# Altium schematic sheet EnvMonitor.SchDoc
size A4
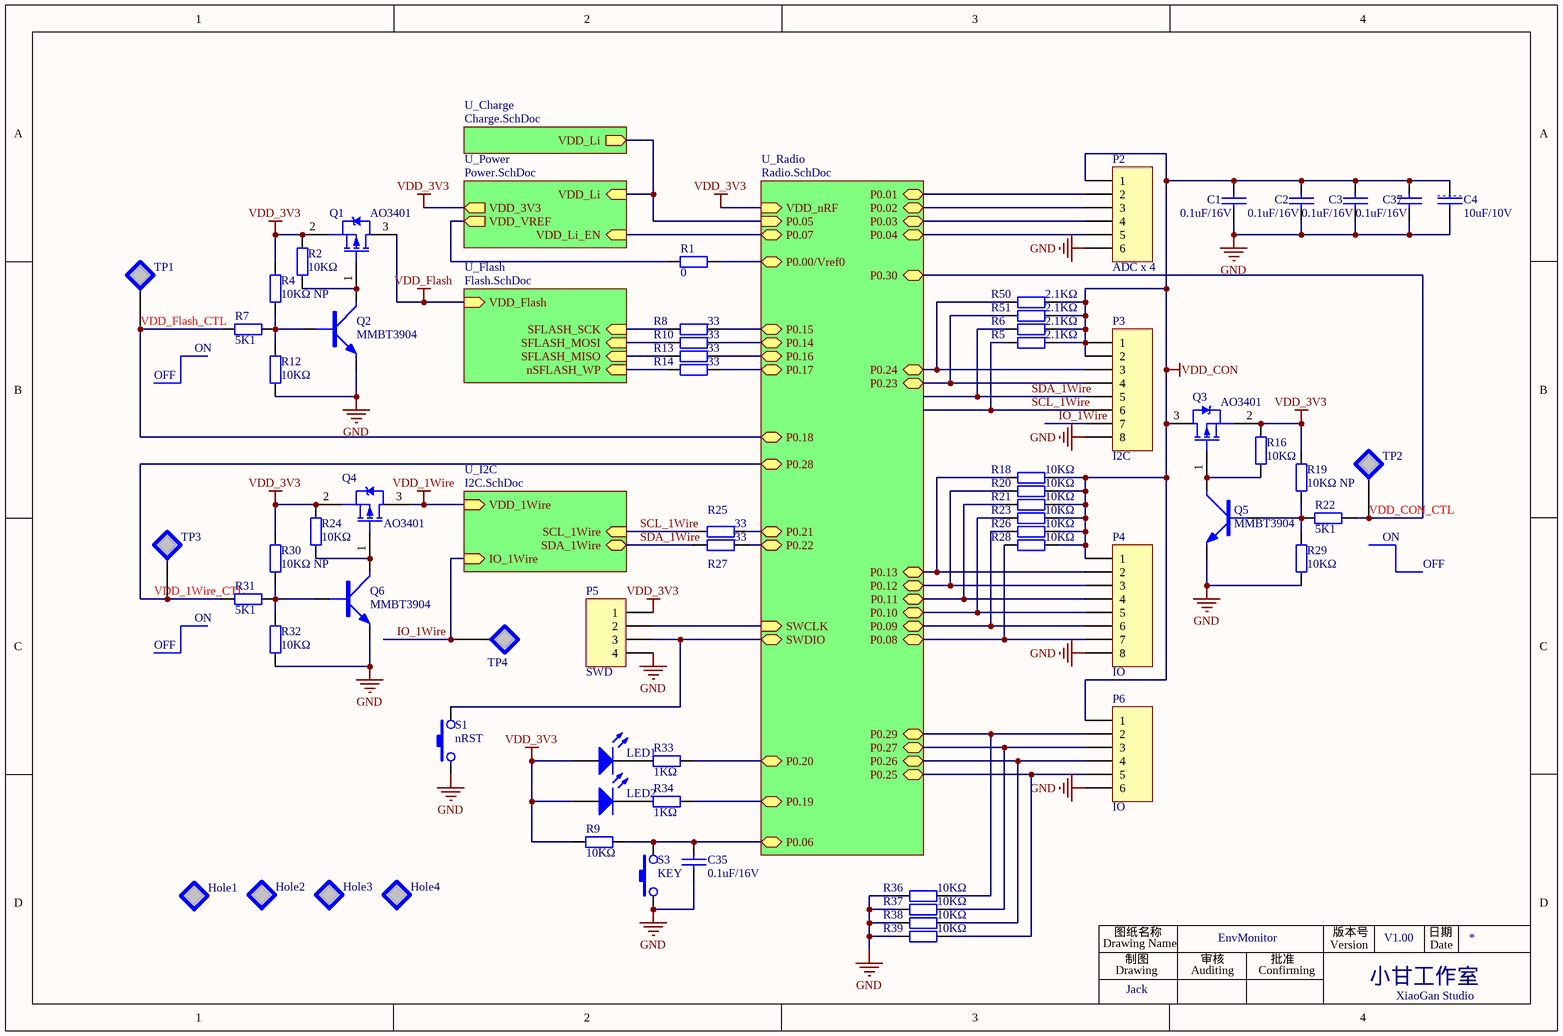
[diagram p0: EnvMonitor.SchDoc]

## Parts
C1  0.1uF/16V  [0603R]
C2  0.1uF/16V  [0603R]
C3  0.1uF/16V  [0603R]
C4  10uF/10V  [0805R]
C35  0.1uF/16V  [0603R]
C37  0.1uF/16V  [0603R]
Hole1  (no value)  [HOLE-3.2]  (no BOM)
Hole2  (no value)  [HOLE-3.2]  (no BOM)
Hole3  (no value)  [HOLE-3.2]  (no BOM)
Hole4  (no value)  [HOLE-3.2]  (no BOM)
LED1  LED_0603  [LED-0603]  (value not drawn)
LED2  LED_0603  [LED-0603]  (value not drawn)
P2  ADC x 4  [CON6-2.0]
P3  I2C  [CON8-2.0]
P4  IO  [CON8-2.0]
P5  SWD  [CON4-2.0]
P6  IO  [CON6-2.0]
Q1  AO3401  [SOT-23]
Q2  MMBT3904  [SOT-23]
Q3  AO3401  [SOT-23]
Q4  AO3401  [SOT-23]
Q5  MMBT3904  [SOT-23]
Q6  MMBT3904  [SOT-23]
R1  0  [0603R]
R2  10KΩ  [0603R]
R4  10KΩ NP  [0603R]
R5  2.1KΩ  [0603R]
R6  2.1KΩ  [0603R]
R7  5K1  [0603R]
R8  33  [0603R]
R9  10KΩ  [0603R]
R10  33  [0603R]
R12  10KΩ  [0603R]
R13  33  [0603R]
R14  33  [0603R]
R16  10KΩ  [0603R]
R18  10KΩ  [0603R]
R19  10KΩ NP  [0603R]
R20  10KΩ  [0603R]
R21  10KΩ  [0603R]
R22  5K1  [0603R]
R23  10KΩ  [0603R]
R24  10KΩ  [0603R]
R25  33  [0603R]
R26  10KΩ  [0603R]
R27  33  [0603R]
R28  10KΩ  [0603R]
R29  10KΩ  [0603R]
R30  10KΩ NP  [0603R]
R31  5K1  [0603R]
R32  10KΩ  [0603R]
R33  1KΩ  [0603R]
R34  1KΩ  [0603R]
R36  10KΩ  [0603R]
R37  10KΩ  [0603R]
R38  10KΩ  [0603R]
R39  10KΩ  [0603R]
R50  2.1KΩ  [0603R]
R51  2.1KΩ  [0603R]
S1  nRST  [KEY-6S]
S3  KEY  [KEY-6S]
TP1  (no value)  [MARKER-C]  (no BOM)
TP2  (no value)  [MARKER-C]  (no BOM)
TP3  (no value)  [MARKER-C]  (no BOM)
TP4  (no value)  [MARKER-C]  (no BOM)

## Sub-sheets
U_Charge = Charge.SchDoc: VDD_Li (out)
U_Flash = Flash.SchDoc: SFLASH_SCK (in), SFLASH_MOSI (in), SFLASH_MISO (in), nSFLASH_WP (in), VDD_Flash (in)
U_I2C = I2C.SchDoc: VDD_1Wire (in), IO_1Wire (in), SDA_1Wire (bidir), SCL_1Wire (in)
U_Power = Power.SchDoc: VDD_Li (in), VDD_3V3 (out), VDD_VREF (out), VDD_Li_EN (in)
U_Radio = Radio.SchDoc: SWDIO (bidir), SWCLK (in), P0.00/Vref0 (bidir), P0.01 (bidir), P0.02 (bidir), P0.03 (bidir), P0.04 (bidir), P0.05 (in), P0.06 (bidir), P0.07 (bidir), P0.08 (bidir), P0.09 (bidir), P0.10 (bidir), P0.11 (bidir), P0.12 (bidir), P0.13 (bidir), P0.14 (bidir), P0.15 (bidir), P0.16 (bidir), P0.17 (bidir), P0.18 (bidir), P0.19 (bidir), P0.20 (bidir), P0.21 (bidir), P0.22 (bidir), P0.23 (bidir), P0.24 (bidir), P0.25 (bidir), P0.26 (bidir), P0.27 (bidir), P0.28 (bidir), P0.29 (bidir), P0.30 (bidir), VDD_nRF (in)

## Nets
GND: C1.2 C2.2 C3.2 C4.2 C35.1 C37.2 P2.6 P3.8 P4.8 P5.4 P6.6 Q2.2 Q5.2 Q6.2 R12.1 R29.1 R32.1 R36.2 R37.2 R38.2 R39.2 S1.1 S3.1
VDD_1Wire: Q4.3(D) ; sheet U_I2C/VDD_1Wire
VDD_3V3: LED1.1(A) LED2.1(A) P5.1 Q1.2(S) Q3.2(S) Q4.2(S) R2.2 R4.2 R9.2 R16.2 R19.2 R24.2 R30.2 ; sheet U_Radio/VDD_nRF, sheet U_Power/VDD_3V3
VDD_CON: C1.1 C2.1 C3.1 C4.1 C37.1 P2.1 P3.1 P3.2 P4.1 P6.1 Q3.3(D) R5.1 R6.1 R18.1 R20.1 R21.1 R23.1 R26.1 R28.1 R50.2 R51.2
VDD_Flash: Q1.3(D) ; sheet U_Flash/VDD_Flash
IO_1Wire: P3.7 TP4.0 ; sheet U_I2C/IO_1Wire
SCL_1Wire: P3.6 R5.2 R25.2 ; sheet U_I2C/SCL_1Wire
SDA_1Wire: P3.5 R6.2 R27.2 ; sheet U_I2C/SDA_1Wire
VDD_1Wire_CTL: R31.2 TP3.0 ; sheet U_Radio/P0.28
VDD_CON_CTL: R22.2 TP2.0 ; sheet U_Radio/P0.30
VDD_Flash_CTL: R7.2 TP1.0 ; sheet U_Radio/P0.18
NetC35_2: C35.2 R9.1 S3.2 ; sheet U_Radio/P0.06
NetLED1_2: LED1.2(K) R33.2
NetLED2_2: LED2.2(K) R34.2
NetP2_2: P2.2 ; sheet U_Radio/P0.01
NetP2_3: P2.3 ; sheet U_Radio/P0.02
NetP2_4: P2.4 ; sheet U_Radio/P0.03
NetP2_5: P2.5 ; sheet U_Radio/P0.04
NetP3_3: P3.3 R50.1 ; sheet U_Radio/P0.24
NetP3_4: P3.4 R51.1 ; sheet U_Radio/P0.23
NetP4_2: P4.2 R18.2 ; sheet U_Radio/P0.13
NetP4_3: P4.3 R20.2 ; sheet U_Radio/P0.12
NetP4_4: P4.4 R21.2 ; sheet U_Radio/P0.11
NetP4_5: P4.5 R23.2 ; sheet U_Radio/P0.10
NetP4_6: P4.6 R26.2 ; sheet U_Radio/P0.09
NetP4_7: P4.7 R28.2 ; sheet U_Radio/P0.08
NetP5_2: P5.2 ; sheet U_Radio/SWCLK
NetP5_3: P5.3 S1.2 ; sheet U_Radio/SWDIO
NetP6_2: P6.2 R36.1 ; sheet U_Radio/P0.29
NetP6_3: P6.3 R37.1 ; sheet U_Radio/P0.27
NetP6_4: P6.4 R38.1 ; sheet U_Radio/P0.26
NetP6_5: P6.5 R39.1 ; sheet U_Radio/P0.25
NetQ1_1: Q1.1(G) Q2.3 R2.1
NetQ2_1: Q2.1 R4.1 R7.1 R12.2
NetQ3_1: Q3.1(G) Q5.3 R16.1
NetQ4_1: Q4.1(G) Q6.3 R24.1
NetQ5_1: Q5.1 R19.1 R22.1 R29.2
NetQ6_1: Q6.1 R30.1 R31.1 R32.2
NetR1_1: R1.1 ; sheet U_Radio/P0.00/Vref0
NetR1_2: R1.2 ; sheet U_Power/VDD_VREF
NetR8_1: R8.1 ; sheet U_Radio/P0.15
NetR8_2: R8.2 ; sheet U_Flash/SFLASH_SCK
NetR10_1: R10.1 ; sheet U_Radio/P0.14
NetR10_2: R10.2 ; sheet U_Flash/SFLASH_MOSI
NetR13_1: R13.1 ; sheet U_Radio/P0.16
NetR13_2: R13.2 ; sheet U_Flash/SFLASH_MISO
NetR14_1: R14.1 ; sheet U_Radio/P0.17
NetR14_2: R14.2 ; sheet U_Flash/nSFLASH_WP
NetR25_1: R25.1 ; sheet U_Radio/P0.21
NetR27_1: R27.1 ; sheet U_Radio/P0.22
NetR33_1: R33.1 ; sheet U_Radio/P0.20
NetR34_1: R34.1 ; sheet U_Radio/P0.19
(unnamed): sheet U_Radio/P0.05, sheet U_Power/VDD_Li, sheet U_Charge/VDD_Li
(unnamed): sheet U_Radio/P0.07, sheet U_Power/VDD_Li_EN

Not connected (* = marked no-connect by the designer): Hole1 0; Hole2 0; Hole3 0; Hole4 0

## Notes on the sheet
- OFF
- (near R7) ON
- (near R22) ON
- (near R31) ON
- Drawing Name
- 图纸名称
- Drawing
- 制图
- Auditing
- 审核
- EnvMonitor
- Confirming
- 批准
- Version
- 版本号
- 小甘工作室
- V1.00
- 日期
- Date
- Jack
- XiaoGan Studio

## Library data of the parts
C1-C4 C35 C37 = CAP: 贴片陶瓷电容; Kind: 贴片陶瓷电容
  C4: Author: 叶建峰
Hole1-Hole4 TP1-TP4 = TESTPOINT: Test Point; Author: 叶建峰
LED1 LED2 = LED_0603: LED_0603 Typical RED, GREEN, YELLOW, AMBER GaAs LED; Type: RED; Package: 0603
P2 P6 = Header 6: Header, 6-Pin; LatestRevisionDate: 17-Jul-2002; LatestRevisionNote: Re-released for DXP Platform.; Publisher: Altium Limited
P3 P4 = Header 8: Header, 8-Pin; LatestRevisionDate: 17-Jul-2002; LatestRevisionNote: Re-released for DXP Platform.; Publisher: Altium Limited
P5 = Header 4: Header, 4-Pin; LatestRevisionDate: 17-Jul-2002; LatestRevisionNote: Re-released for DXP Platform.; Publisher: Altium Limited
Q1 Q3 Q4 = DMP3098L: -30V,-3.8A   PMOS  70-120mΩ; Manufacturer: DIODES; Kind: 贴片MOS管; Remark: 关键元器件
Q2 Q5 Q6 = 9013: NPN三极管; Kind: 贴片三极管
R1 R2 R4-R10 R12-R14 R16 R18-R34 R36-R39 R50 R51 = RES_0603: OEMs: *; Type: 10KΩ; Package: 0603
S1 S3 = SW-PB